# EAGLE board buck (EAGLE 9.3.0), part 1 of 2
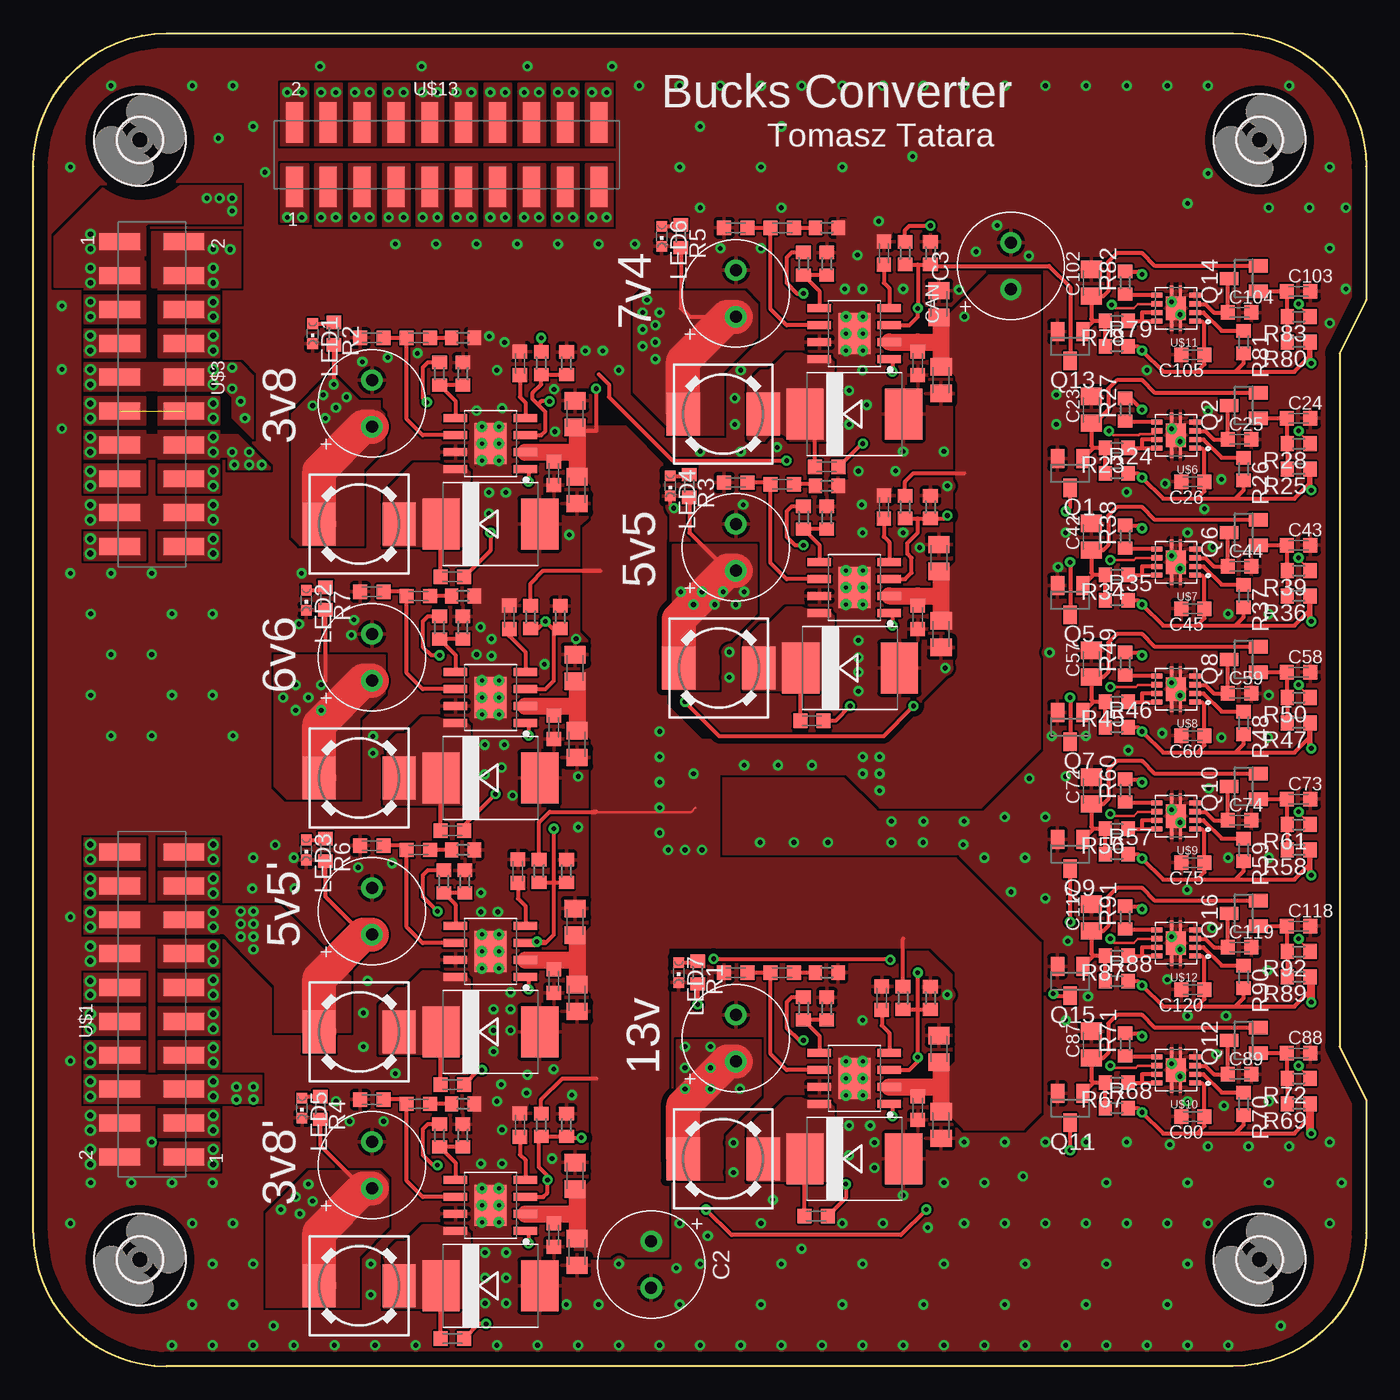
[diagram p4: board, top side]
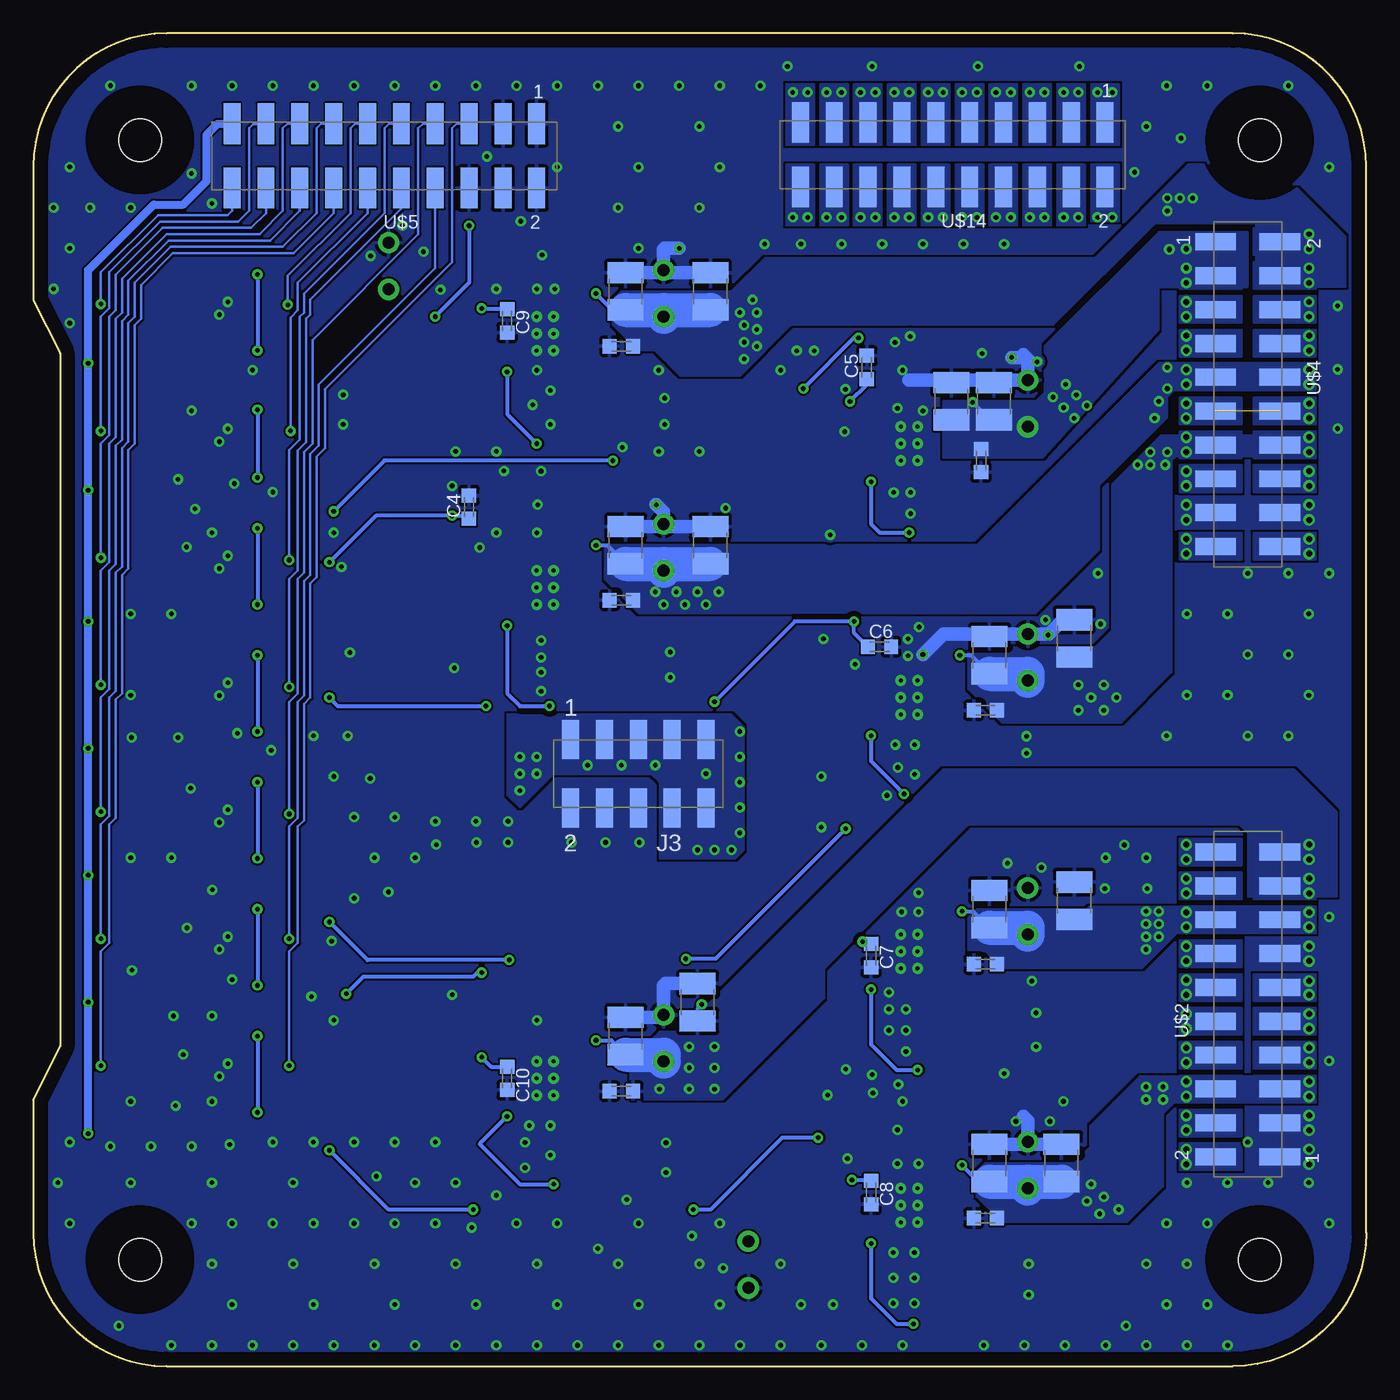
[diagram p5: board, bottom side, seen from below]

Size 100 x 100 mm. Coordinates in mm from the lower left corner, seen from the top.
Outline: 0,10 0,90 arc-90 10,100 90,100 arc-90 100,90 100,80 98,76 98,24 100,20 100,10 arc-90 90,0 10,0 arc-90 0,10
Copper layers (1*16): Top 0.035mm / dielectric 1.5mm / Bottom 0.035mm
Design rules "default *": minimum track width 6mil, minimum drill 0.35mm, track to track 6mil, track to pad 6mil, pad to pad 6mil, via to via 6mil, smd to smd 6mil, copper to edge 40mil, drill to drill 6mil, minimum pad ring 10mil, minimum via ring 8mil, stop-mask expansion 4mil, vias tented up to drill 14mil, thermal gap 10mil
Net classes: 1 test: width 0.254 mm, drill 3.5 mm, clearance 0.356 mm

## Footprints (pad centres in the part's own frame; a part is rotated, then mirrored left to right if it is on the bottom)
C0603K = smd 1.05 x 1.08: 1 -0.875,0; 2 0.875,0
CAPPRD350W65D800H1150A = drill 0.9 pad 1.6: 1 -1.75,0; 2 1.75,0
C0805K = smd 1.3 x 1.6: 1 -1,0; 2 1,0
C1210 = smd 1.6 x 2.7: 1 -1.4,0; 2 1.4,0
SMC = smd 2.8 x 3.8: A 3.7,0; C -3.7,0
3,2 = hole 3.2: 0,0
SSM-105-XXX-DV = smd 1.27 x 2.921: 1 5.08,-2.572; 2 5.08,2.572; 3 2.54,-2.572; 4 2.54,2.572; 5 0,-2.572; 6 0,2.572; 7 -2.54,-2.572; 8 -2.54,2.572; 9 -5.08,-2.572; 10 -5.08,2.572
DR74 = smd 2.5 x 3.25: 1 -3,0; 2 3,0
CHIPLED_0603 = smd 0.8 x 0.8: A 0,-0.75; C 0,0.75
SOT23 = smd 1 x 1.4: 1 -0.95,-1.1; 2 0.95,-1.1; 3 0,1.1
R0603 = smd 1 x 1.1: 1 -0.85,0; 2 0.85,0
SOIC127P600X150-9T240X310 = smd 1.778 x 0.61: 1 -2.625,1.905; 2 -2.625,0.635; 3 -2.625,-0.635; 4 -2.625,-1.905; 5 2.625,-1.905; 6 2.625,-0.635; 7 2.625,0.635; 8 2.625,1.905 | smd 2.4 x 3.1: 9 0,0 | drill 0.3: P$1 -0.635,1.27; P$2 0.635,1.27; P$3 -0.635,0; P$4 0.635,0; P$5 -0.635,-1.27; P$6 0.635,-1.27
IPT1-110-01-X-D-VS = smd 1.27 x 3.048: 1 -11.43,-2.413; 2 -11.43,2.413; 3 -8.89,-2.413; 4 -8.89,2.413; 5 -6.35,-2.413; 6 -6.35,2.413; 7 -3.81,-2.413; 8 -3.81,2.413; 9 -1.27,-2.413; 10 -1.27,2.413; 11 1.27,-2.413; 12 1.27,2.413; 13 3.81,-2.413; 14 3.81,2.413; 15 6.35,-2.413; 16 6.35,2.413; 17 8.89,-2.413; 18 8.89,2.413; 19 11.43,-2.413; 20 11.43,2.413
SON65P300X300X100-9N = smd 0.86 x 0.33: 1 -1.435,0.975; 2 -1.435,0.325; 3 -1.435,-0.325; 4 -1.435,-0.975; 5 1.435,-0.975; 6 1.435,-0.325; 7 1.435,0.325; 8 1.435,0.975 | smd 1.5 x 1.75: 9 0,0 | smd 0.23 x 0.825: 9_1 -0.325,1.288; 9_2 0.325,1.288; 9_3 -0.325,-1.288; 9_4 0.325,-1.288

## Placement (x,y rotation side)
C1  10n  [C0603K]  36.51,75.25 90 top
C2  8X11.5_POL  [CAPPRD350W65D800H1150A]  46.35,7.62 270 top
C3  8X11.5_POL  [CAPPRD350W65D800H1150A]  73.34,82.55 90 top
C4  100n  [C0603K]  67.31,64.45 90 bottom
C5  100n  [C0603K]  37.47,74.93 90 bottom
C6  100n  [C0603K]  36.51,53.98 0 bottom
C7  100n  [C0603K]  37.15,30.8 270 bottom
C8  100n  [C0603K]  37.15,13.02 270 bottom
C9  100n  [C0603K]  64.45,78.42 270 bottom
C10  100n  [C0603K]  64.45,21.59 270 bottom
C13  4u7  [C0805K]  40.64,71.44 90 top
C14  4u7  [C0805K]  40.8,65.72 270 top
C15  100n  [C0603K]  39.05,66.99 270 top
C16  2n2  [C0603K]  28.89,77.15 0 top
C17  22n  [C0603K]  25.4,77.15 180 top
C18  100n  [C0603K]  31.43,59.21 180 top
C19  8X11.5_POL  [CAPPRD350W65D800H1150A]  25.4,72.23 90 top
C20  47u  [C1210]  31.11,72.39 90 bottom
C21  1u  [C0603K]  28.89,67.94 270 bottom
C22  47u  [C1210]  27.94,72.39 90 bottom
C23  10u  [C0805K]  79.38,71.75 90 top
C24  100n  [C0603K]  94.93,71.12 0 top
C25  100n  [C0603K]  90.49,69.53 0 top
C26  100n  [C0603K]  87,66.36 180 top
C31  10n  [C0603K]  63.82,64.45 90 top
C32  4u7  [C0805K]  67.94,60.64 90 top
C33  4u7  [C0805K]  68.1,54.93 270 top
C34  100n  [C0603K]  66.36,56.2 270 top
C35  2n2  [C0603K]  56.2,66.17 0 top
C36  22n  [C0603K]  52.7,66.29 180 top
C37  100n  [C0603K]  58.42,48.42 180 top
C38  8X11.5_POL  [CAPPRD350W65D800H1150A]  52.7,61.44 90 top
C39  47u  [C1210]  49.21,61.59 90 bottom
C40  1u  [C0603K]  55.88,57.47 180 bottom
C41  47u  [C1210]  55.56,61.59 90 bottom
C42  10u  [C0805K]  79.38,62.23 90 top
C43  100n  [C0603K]  94.93,61.59 0 top
C44  100n  [C0603K]  90.49,60.01 0 top
C45  100n  [C0603K]  87,56.83 180 top
C46  10n  [C0603K]  35.72,56.2 90 top
C47  4u7  [C0805K]  40.64,52.39 90 top
C48  4u7  [C0805K]  40.8,46.67 270 top
C49  100n  [C0603K]  39.05,47.94 270 top
C50  2n2  [C0603K]  28.89,57.78 0 top
C51  22n  [C0603K]  25.4,58.1 180 top
C52  100n  [C0603K]  31.43,40.16 180 top
C53  8X11.5_POL  [CAPPRD350W65D800H1150A]  25.4,53.18 90 top
C54  47u  [C1210]  21.91,54.61 90 bottom
C55  1u  [C0603K]  28.57,49.21 180 bottom
C56  47u  [C1210]  28.26,53.34 90 bottom
C57  10u  [C0805K]  79.38,52.7 90 top
C58  100n  [C0603K]  94.93,52.07 0 top
C59  100n  [C0603K]  90.49,50.48 0 top
C60  100n  [C0603K]  87,47.31 180 top
C61  10n  [C0603K]  36.35,37.15 90 top
C62  4u7  [C0805K]  40.64,33.34 90 top
C63  4u7  [C0805K]  40.8,27.62 270 top
C64  100n  [C0603K]  39.05,28.89 270 top
C65  2n2  [C0603K]  28.89,38.73 0 top
C66  22n  [C0603K]  25.4,39.05 180 top
C67  100n  [C0603K]  31.43,21.11 180 top
C68  8X11.5_POL  [CAPPRD350W65D800H1150A]  25.4,34.13 90 top
C69  47u  [C1210]  21.91,34.92 90 bottom
C70  1u  [C0603K]  28.57,30.16 180 bottom
C71  47u  [C1210]  28.26,34.29 90 bottom
C72  10u  [C0805K]  79.38,43.18 90 top
C73  100n  [C0603K]  94.93,42.55 0 top
C74  100n  [C0603K]  90.49,40.96 0 top
C75  100n  [C0603K]  87,37.78 180 top
C76  10n  [C0603K]  36.51,18.1 90 top
C77  4u7  [C0805K]  40.64,14.29 90 top
C78  4u7  [C0805K]  40.8,8.57 270 top
C79  100n  [C0603K]  39.05,9.84 270 top
C80  2n2  [C0603K]  28.89,19.68 0 top
C81  22n  [C0603K]  25.4,20 180 top
C82  100n  [C0603K]  31.43,2.06 180 top
C83  8X11.5_POL  [CAPPRD350W65D800H1150A]  25.4,15.08 90 top
C84  47u  [C1210]  22.86,15.24 90 bottom
C85  1u  [C0603K]  28.57,11.11 180 bottom
C86  47u  [C1210]  28.26,15.24 90 bottom
C87  10u  [C0805K]  79.38,24.13 90 top
C88  100n  [C0603K]  94.93,23.5 0 top
C89  100n  [C0603K]  90.49,21.91 0 top
C90  100n  [C0603K]  87,18.73 180 top
C91  10n  [C0603K]  63.82,83.5 90 top
C92  4u7  [C0805K]  67.94,79.69 90 top
C93  4u7  [C0805K]  68.1,73.98 270 top
C94  100n  [C0603K]  66.36,75.25 270 top
C95  2n2  [C0603K]  56.2,85.41 0 top
C96  22n  [C0603K]  52.7,85.41 180 top
C97  100n  [C0603K]  59.53,67.47 180 top
C98  8X11.5_POL  [CAPPRD350W65D800H1150A]  52.7,80.49 90 top
C99  47u  [C1210]  49.21,80.64 90 bottom
C100  1u  [C0603K]  55.88,76.52 180 bottom
C101  47u  [C1210]  55.56,80.64 90 bottom
C102  10u  [C0805K]  79.38,81.28 90 top
C103  100n  [C0603K]  94.93,80.64 0 top
C104  100n  [C0603K]  90.49,79.06 0 top
C105  100n  [C0603K]  87,75.88 180 top
C106  10n  [C0603K]  63.66,27.62 90 top
C107  4u7  [C0805K]  67.94,23.81 90 top
C108  4u7  [C0805K]  68.1,18.1 270 top
C109  100n  [C0603K]  66.36,19.37 270 top
C110  2n2  [C0603K]  56.2,29.53 0 top
C111  22n  [C0603K]  52.7,29.53 180 top
C112  100n  [C0603K]  58.74,11.27 180 top
C113  8X11.5_POL  [CAPPRD350W65D800H1150A]  52.7,24.61 90 top
C114  47u  [C1210]  50.16,27.3 90 bottom
C115  1u  [C0603K]  55.88,20.64 180 bottom
C116  47u  [C1210]  55.56,24.77 90 bottom
C117  10u  [C0805K]  79.38,33.66 90 top
C118  100n  [C0603K]  94.93,33.02 0 top
C119  100n  [C0603K]  90.49,31.43 0 top
C120  100n  [C0603K]  87,28.26 180 top
D2  CDBC540-G  [SMC]  61.59,15.56 0 top
D3  CDBC540-G  [SMC]  34.29,63.18 0 top
D4  CDBC540-G  [SMC]  61.28,52.39 0 top
D5  CDBC540-G  [SMC]  34.29,44.13 0 top
D6  CDBC540-G  [SMC]  34.29,25.08 0 top
D7  CDBC540-G  [SMC]  34.29,6.03 0 top
D8  CDBC540-G  [SMC]  61.59,71.44 0 top
H1  MOUNT-HOLE3.2  [3,2]  8,92 0 top
H2  MOUNT-HOLE3.2  [3,2]  8,8 0 top
H3  MOUNT-HOLE3.2  [3,2]  92,8 0 top
H4  MOUNT-HOLE3.2  [3,2]  92,92 0 top
J3  SSM-105-XXX-DV  [SSM-105-XXX-DV]  54.61,44.45 180 bottom
L2  ASPI-0630LR-4R7M-T15  [DR74]  24.45,63.18 180 top
L3  ASPI-0630LR-4R7M-T15  [DR74]  51.44,52.39 180 top
L4  ASPI-0630LR-4R7M-T15  [DR74]  24.45,44.13 180 top
L5  ASPI-0630LR-4R7M-T15  [DR74]  24.45,25.08 180 top
L6  ASPI-0630LR-4R7M-T15  [DR74]  24.45,6.03 180 top
L7  ASPI-0630LR-4R7M-T15  [DR74]  51.75,71.44 180 top
L8  ASPI-0630LR-4R7M-T15  [DR74]  51.75,15.56 180 top
LED1  [CHIPLED_0603]  20.95,77.47 180 top
LED2  [CHIPLED_0603]  20.48,57.47 180 top
LED3  [CHIPLED_0603]  20.48,38.73 180 top
LED4  [CHIPLED_0603]  47.78,66.04 180 top
LED5  [CHIPLED_0603]  20.16,19.37 180 top
LED6  [CHIPLED_0603]  47.15,84.77 180 top
LED7  [CHIPLED_0603]  48.42,29.53 180 top
Q1  BSS123  [SOT23]  77.79,66.99 180 top
Q2  BSS123  [SOT23]  90.81,72.07 90 top
Q5  BSS123  [SOT23]  77.79,57.47 180 top
Q6  BSS123  [SOT23]  90.81,62.55 90 top
Q7  BSS123  [SOT23]  77.79,47.94 180 top
Q8  BSS123  [SOT23]  90.81,53.02 90 top
Q9  BSS123  [SOT23]  77.79,38.42 180 top
Q10  BSS123  [SOT23]  90.81,43.5 90 top
Q11  BSS123  [SOT23]  77.79,19.37 180 top
Q12  BSS123  [SOT23]  90.81,24.45 90 top
Q13  BSS123  [SOT23]  77.79,76.52 180 top
Q14  BSS123  [SOT23]  90.81,81.6 90 top
Q15  BSS123  [SOT23]  77.79,28.89 180 top
Q16  BSS123  [SOT23]  90.81,33.97 90 top
R1  5k  [R0603]  49.85,29.53 270 top
R2  5k  [R0603]  22.54,77.47 270 top
R3  5k  [R0603]  49.21,66.04 270 top
R4  5k  [R0603]  21.53,19.37 270 top
R5  5k  [R0603]  48.58,84.77 270 top
R6  5k  [R0603]  21.91,38.73 270 top
R7  5k  [R0603]  21.91,57.59 270 top
R10  330k  [R0603]  65.25,27.62 90 top
R11  45.3k  [R0603]  67.31,27.62 270 top
R12  330k  [R0603]  38.1,75.25 90 top
R13  45.3k  [R0603]  40.01,75.25 270 top
R14  10k 0.1  [R0603]  30.48,74.45 90 top
R17  1.37k 0.1  [R0603]  32.23,74.45 270 top
R18  37k4  [R0603]  32.23,77.15 0 top
R23  500R  [R0603]  81.28,68.9 180 top
R24  5k  [R0603]  81.28,66.99 0 top
R25  [R0603]  94.93,67.31 180 top
R26  10k  [R0603]  90.81,67.31 270 top
R27  0R  [R0603]  81.92,71.75 90 top
R28  200R  [R0603]  94.93,69.22 180 top
R29  330k  [R0603]  65.41,64.45 90 top
R30  45.3k  [R0603]  67.31,64.45 270 top
R31  10k 0.1  [R0603]  57.78,63.66 90 top
R32  1.37k 0.1  [R0603]  59.53,63.66 270 top
R33  37k4  [R0603]  59.53,66.04 0 top
R34  500R  [R0603]  81.28,59.37 180 top
R35  5k  [R0603]  81.28,57.47 0 top
R36  [R0603]  94.93,57.78 180 top
R37  10k  [R0603]  90.81,57.78 270 top
R38  0R  [R0603]  81.92,62.23 90 top
R39  200R  [R0603]  94.93,59.69 180 top
R40  330k  [R0603]  37.31,56.2 90 top
R41  45.3k  [R0603]  39.53,56.2 270 top
R42  10k 0.1  [R0603]  30.48,55.4 90 top
R43  1.37k 0.1  [R0603]  32.23,55.4 270 top
R44  37k4  [R0603]  32.23,57.78 0 top
R45  500R  [R0603]  81.28,49.85 180 top
R46  5k  [R0603]  81.28,47.94 0 top
R47  [R0603]  94.93,48.26 180 top
R48  10k  [R0603]  90.81,48.26 270 top
R49  0R  [R0603]  81.92,52.7 90 top
R50  200R  [R0603]  94.93,50.16 180 top
R51  330k  [R0603]  37.94,37.15 90 top
R52  45.3k  [R0603]  40.01,37.15 270 top
R53  10k 0.1  [R0603]  30.8,36.35 90 top
R54  1.37k 0.1  [R0603]  32.38,36.35 270 top
R55  37k4  [R0603]  32.23,38.73 0 top
R56  500R  [R0603]  81.28,40.32 180 top
R57  5k  [R0603]  81.28,38.42 0 top
R58  [R0603]  94.93,38.73 180 top
R59  10k  [R0603]  90.81,38.73 270 top
R60  0R  [R0603]  81.92,43.18 90 top
R61  200R  [R0603]  94.93,40.64 180 top
R62  330k  [R0603]  38.1,18.1 90 top
R63  45.3k  [R0603]  40.01,18.1 270 top
R64  10k 0.1  [R0603]  30.48,17.3 90 top
R65  1.37k 0.1  [R0603]  32.23,17.3 270 top
R66  37k4  [R0603]  32.23,19.68 0 top
R67  500R  [R0603]  81.28,21.27 180 top
R68  5k  [R0603]  81.28,19.37 0 top
R69  [R0603]  94.93,19.68 180 top
R70  10k  [R0603]  90.81,19.68 270 top
R71  0R  [R0603]  81.92,24.13 90 top
R72  200R  [R0603]  94.93,21.59 180 top
R73  330k  [R0603]  65.41,83.5 90 top
R74  45.3k  [R0603]  67.31,83.5 270 top
R75  10k 0.1  [R0603]  57.78,82.71 90 top
R76  1.37k 0.1  [R0603]  59.53,82.71 270 top
R77  37k4  [R0603]  59.53,85.41 0 top
R78  500R  [R0603]  81.28,78.42 180 top
R79  5k  [R0603]  81.28,76.52 0 top
R80  [R0603]  94.93,76.83 180 top
R81  10k  [R0603]  90.81,76.83 270 top
R82  0R  [R0603]  81.92,81.28 90 top
R83  200R  [R0603]  94.93,78.74 180 top
R84  10k 0.1  [R0603]  57.78,26.83 90 top
R85  1.37k 0.1  [R0603]  59.53,26.83 270 top
R86  37k4  [R0603]  59.53,29.53 0 top
R87  500R  [R0603]  81.28,30.8 180 top
R88  5k  [R0603]  81.28,28.89 0 top
R89  [R0603]  94.93,29.21 180 top
R90  10k  [R0603]  90.81,29.21 270 top
R91  0R  [R0603]  81.92,33.66 90 top
R92  200R  [R0603]  94.93,31.11 180 top
U2  TPS54531DDA_3D  [SOIC127P600X150-9T240X310]  34.29,69.22 180 top
U3  TPS54531DDA_3D  [SOIC127P600X150-9T240X310]  61.59,58.42 180 top
U4  TPS54531DDA_3D  [SOIC127P600X150-9T240X310]  34.29,50.16 180 top
U5  TPS54531DDA_3D  [SOIC127P600X150-9T240X310]  34.29,31.11 180 top
U6  TPS54531DDA_3D  [SOIC127P600X150-9T240X310]  34.29,12.06 180 top
U7  TPS54531DDA_3D  [SOIC127P600X150-9T240X310]  61.59,77.47 180 top
U8  TPS54531DDA_3D  [SOIC127P600X150-9T240X310]  61.59,21.59 180 top
U$1  IPT1-110-01-X-D-VS  [IPT1-110-01-X-D-VS]  8.89,27.15 90 top
U$2  IPT1-110-01-X-D-VS  [IPT1-110-01-X-D-VS]  8.89,27.15 90 bottom
U$3  IPT1-110-01-X-D-VS  [IPT1-110-01-X-D-VS]  8.89,72.92 270 top
U$4  IPT1-110-01-X-D-VS  [IPT1-110-01-X-D-VS]  8.89,72.92 270 bottom
U$5  IPT1-110-01-X-D-VS  [IPT1-110-01-X-D-VS]  73.66,90.81 180 bottom
U$6  TPS3852  [SON65P300X300X100-9N]  85.72,69.85 180 top
U$7  TPS3852  [SON65P300X300X100-9N]  85.72,60.33 180 top
U$8  TPS3852  [SON65P300X300X100-9N]  85.72,50.8 180 top
U$9  TPS3852  [SON65P300X300X100-9N]  85.72,41.27 180 top
U$10  TPS3852  [SON65P300X300X100-9N]  85.72,22.23 180 top
U$11  TPS3852  [SON65P300X300X100-9N]  85.72,79.38 180 top
U$12  TPS3852  [SON65P300X300X100-9N]  85.72,31.75 180 top
U$13  IPT1-110-01-X-D-VS  [IPT1-110-01-X-D-VS]  31.02,90.89 0 top
U$14  IPT1-110-01-X-D-VS  [IPT1-110-01-X-D-VS]  31.02,90.89 180 bottom